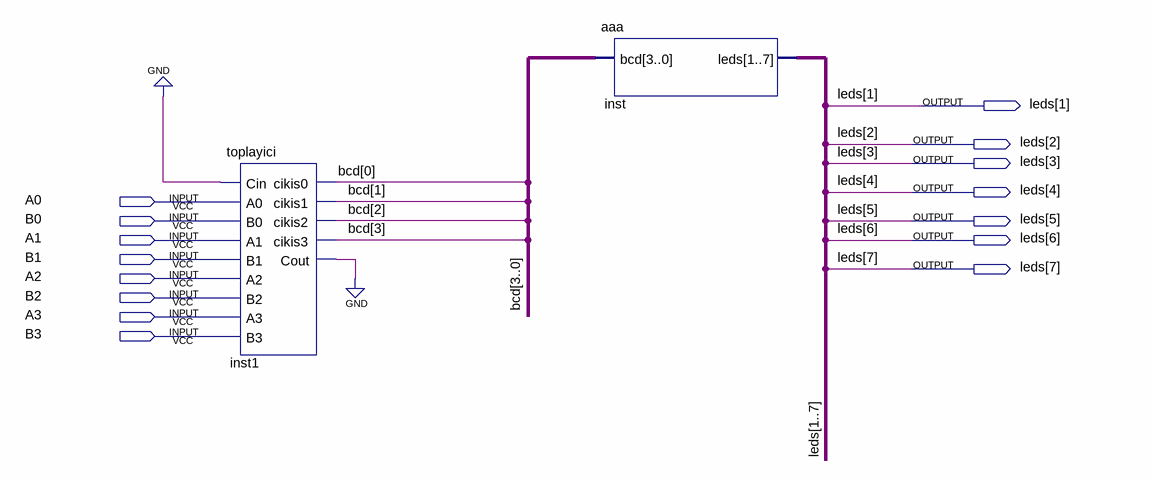
[diagram p0: schematic sheet]
// Quartus schematic toplayicidisplay.bdf as structural Verilog: 2 symbols, 15 pins
module toplayicidisplay (
  input  A0,
  input  B0,
  input  A1,
  input  B1,
  input  A2,
  input  B2,
  input  A3,
  input  B3,
  output [7:1] leds
);

  wire inst1_cout;
  wire [3:0] bcd;

  toplayici inst1 (
    .Cin(1'b0), .A0(A0), .B0(B0), .A1(A1), .B1(B1), .A2(A2), .B2(B2), .A3(A3), .B3(B3), .cikis0(bcd[0]),
    .cikis1(bcd[1]), .cikis2(bcd[2]), .cikis3(bcd[3]), .Cout(inst1_cout));
  aaa inst (.bcd(bcd), .leds({leds[1], leds[2], leds[3], leds[4], leds[5], leds[6], leds[7]}));
  // also tied to GND on the sheet: inst1_cout
endmodule
